# EAGLE design untitled (EAGLE 9.6.2)
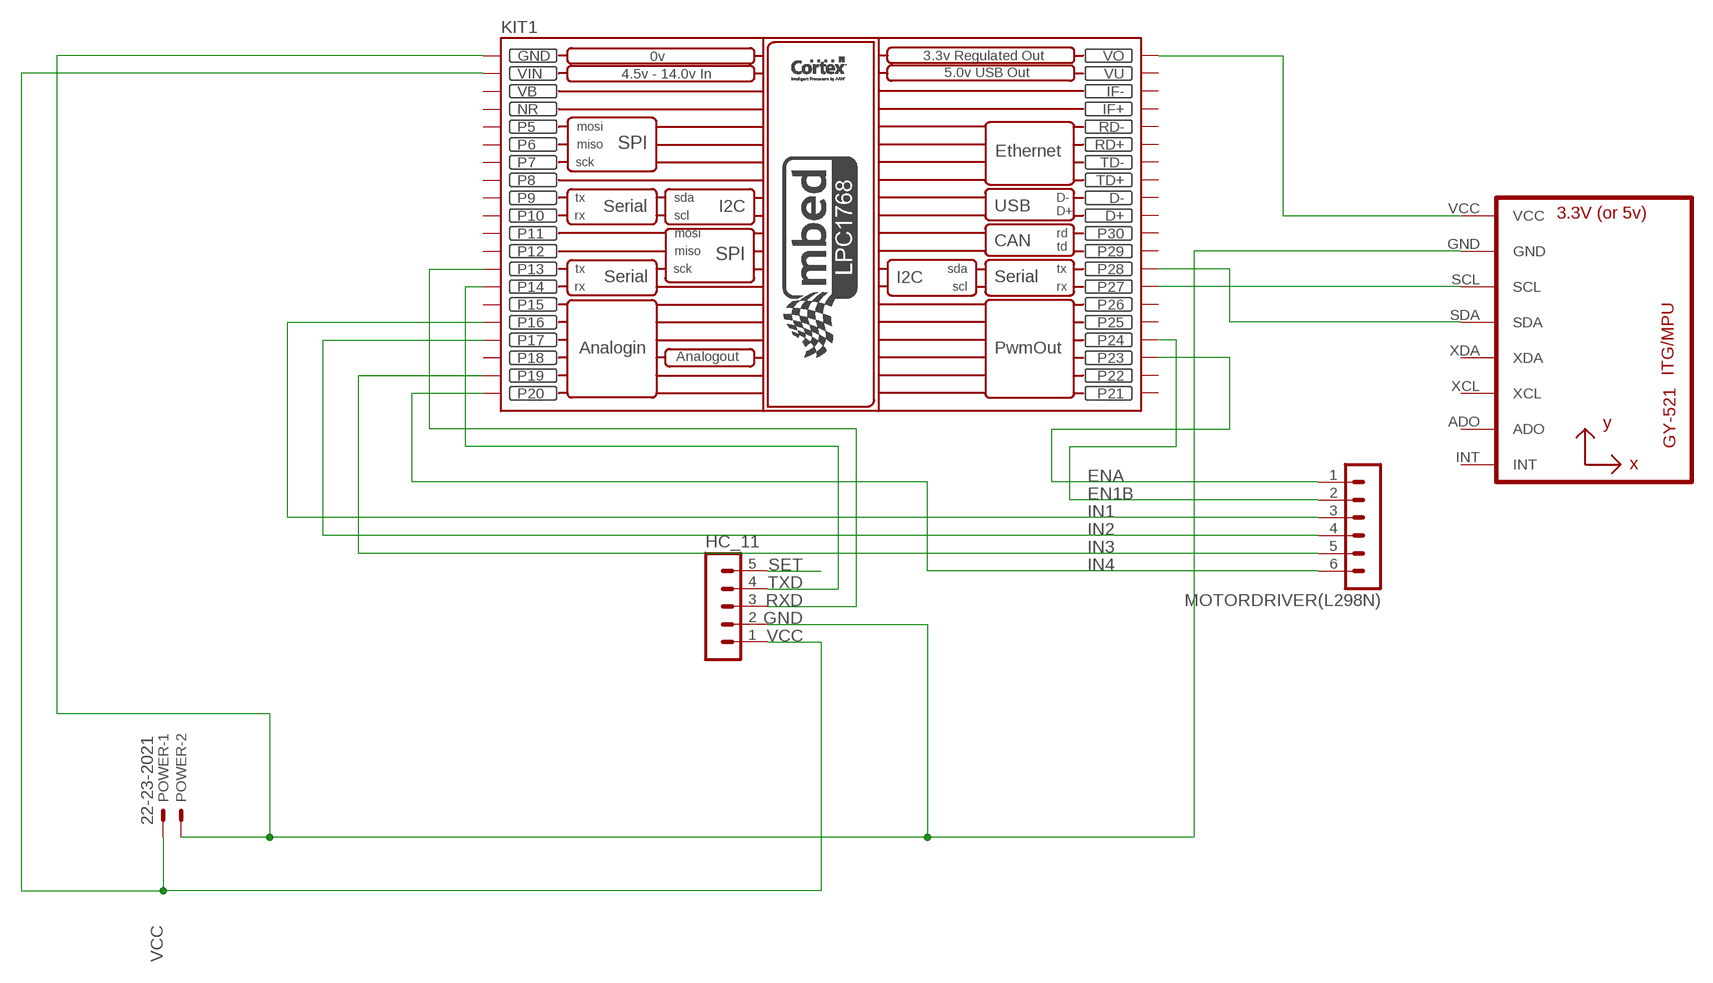
[diagram p0: schematic, sheet 1]

## Parts
HC_11  MA05-1  [MA05-1]
KIT1  MBED_NXP_LPC1768  [MBED-KIT]
MOTORDRIVER(L298N)  MA06-1  [MA06-1]
POWER  22-23-2021  [22-23-2021]
U1  GY-521MPU6050  [GY-521]

## Nets
EN1B: KIT1.P$24(P24) MOTORDRIVER(L298N).2
ENA: KIT1.P$23(P23) MOTORDRIVER(L298N).1
GND: HC_11.2 KIT1.GND POWER.2 U1.GND
IN1: KIT1.P$16(P16) MOTORDRIVER(L298N).3
IN2: KIT1.P$17(P17) MOTORDRIVER(L298N).4
IN3: KIT1.P$19(P19) MOTORDRIVER(L298N).5
IN4: KIT1.P$20(P20) MOTORDRIVER(L298N).6
N$3: KIT1.VOUT(VO) U1.VCC
RXD: HC_11.3 KIT1.P$13(P13)
SCL: KIT1.P$27(P27) U1.SCL
SDA: KIT1.P$28(P28) U1.SDA
SET: HC_11.5
TXD: HC_11.4 KIT1.P$14(P14)
VCC: HC_11.1 KIT1.VIN POWER.1
Unconnected: KIT1.D+ KIT1.D- KIT1.IF+ KIT1.IF- KIT1.P$5(P5) KIT1.P$6(P6) KIT1.P$7(P7) KIT1.P$8(P8) KIT1.P$9(P9) KIT1.P$10(P10) KIT1.P$11(P11) KIT1.P$12(P12) KIT1.P$15(P15) KIT1.P$18(P18) KIT1.P$21(P21) KIT1.P$22(P22) KIT1.P$25(P25) KIT1.P$26(P26) KIT1.P$29(P29) KIT1.P$30(P30) KIT1.RD+ KIT1.RD- KIT1.TD+ KIT1.TD- U1.ADO U1.INT U1.XCL U1.XDA

## Power pins joined to a net without a drawn wire
NR: KIT1.NR
VB: KIT1.VB
VU: KIT1.VU

## Library data of the parts
HC_11 = con-lstb:MA05-1: PIN HEADER; OC_FARNELL: unknown; OC_NEWARK: unknown
KIT1 = MBED_v2.1:MBED_NXP_LPC1768: Mbed LPC1768 - ARM CORTEX v2.1 * Schematic symbol is now placed in eagles's default raster. *The pads diameter are suitable for routing between mbed pins * mbed pads are 0.8 mm drill diameter. --------------------------------------------- Created by: Mohamed Yousry *Alexandria, Egypt *Email: mohamed.yousry@ieeegoldegypt.org
MOTORDRIVER(L298N) = con-lstb:MA06-1: PIN HEADER; OC_FARNELL: unknown; OC_NEWARK: unknown
POWER = con-molex:22-23-2021: .100" (2.54mm) Center Header - 2 Pin; MF: MOLEX; MPN: 22-23-2021; OC_FARNELL: 1462926; OC_NEWARK: 25C3832
U1 = gy-521 (1):GY-521

## Board
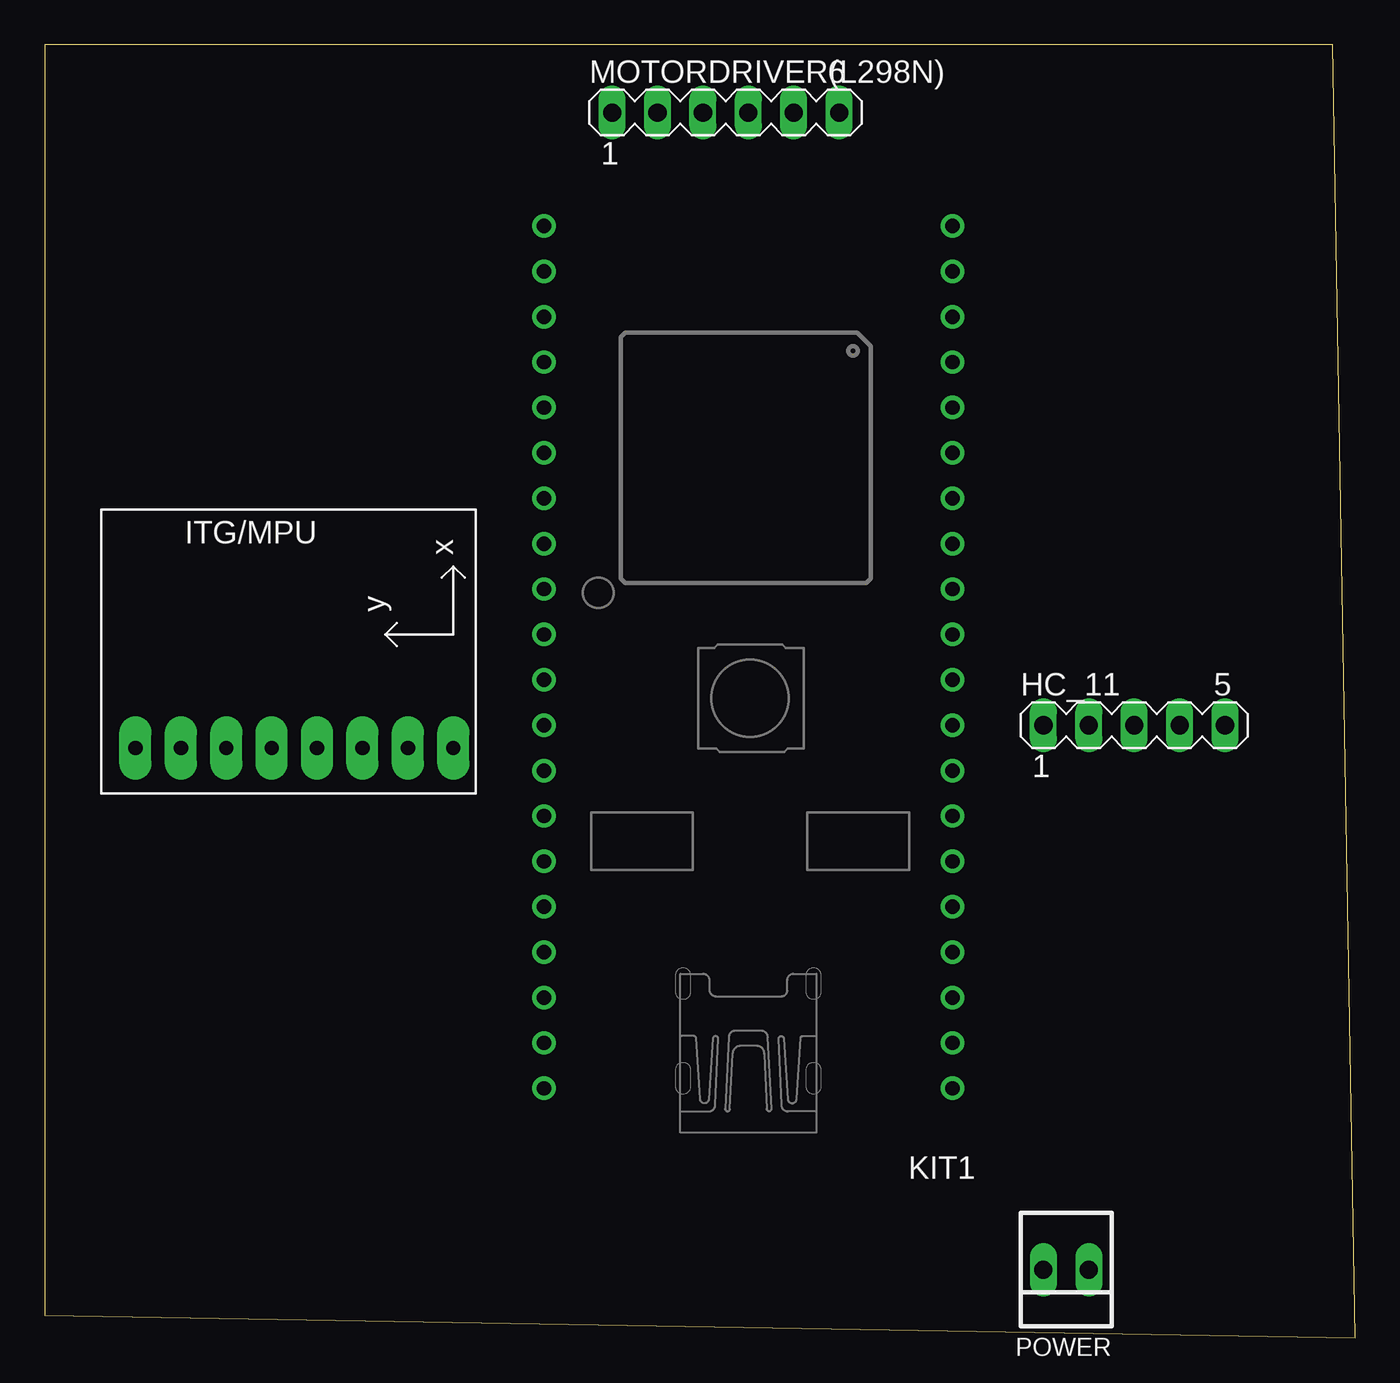
[diagram p1: board, top side]
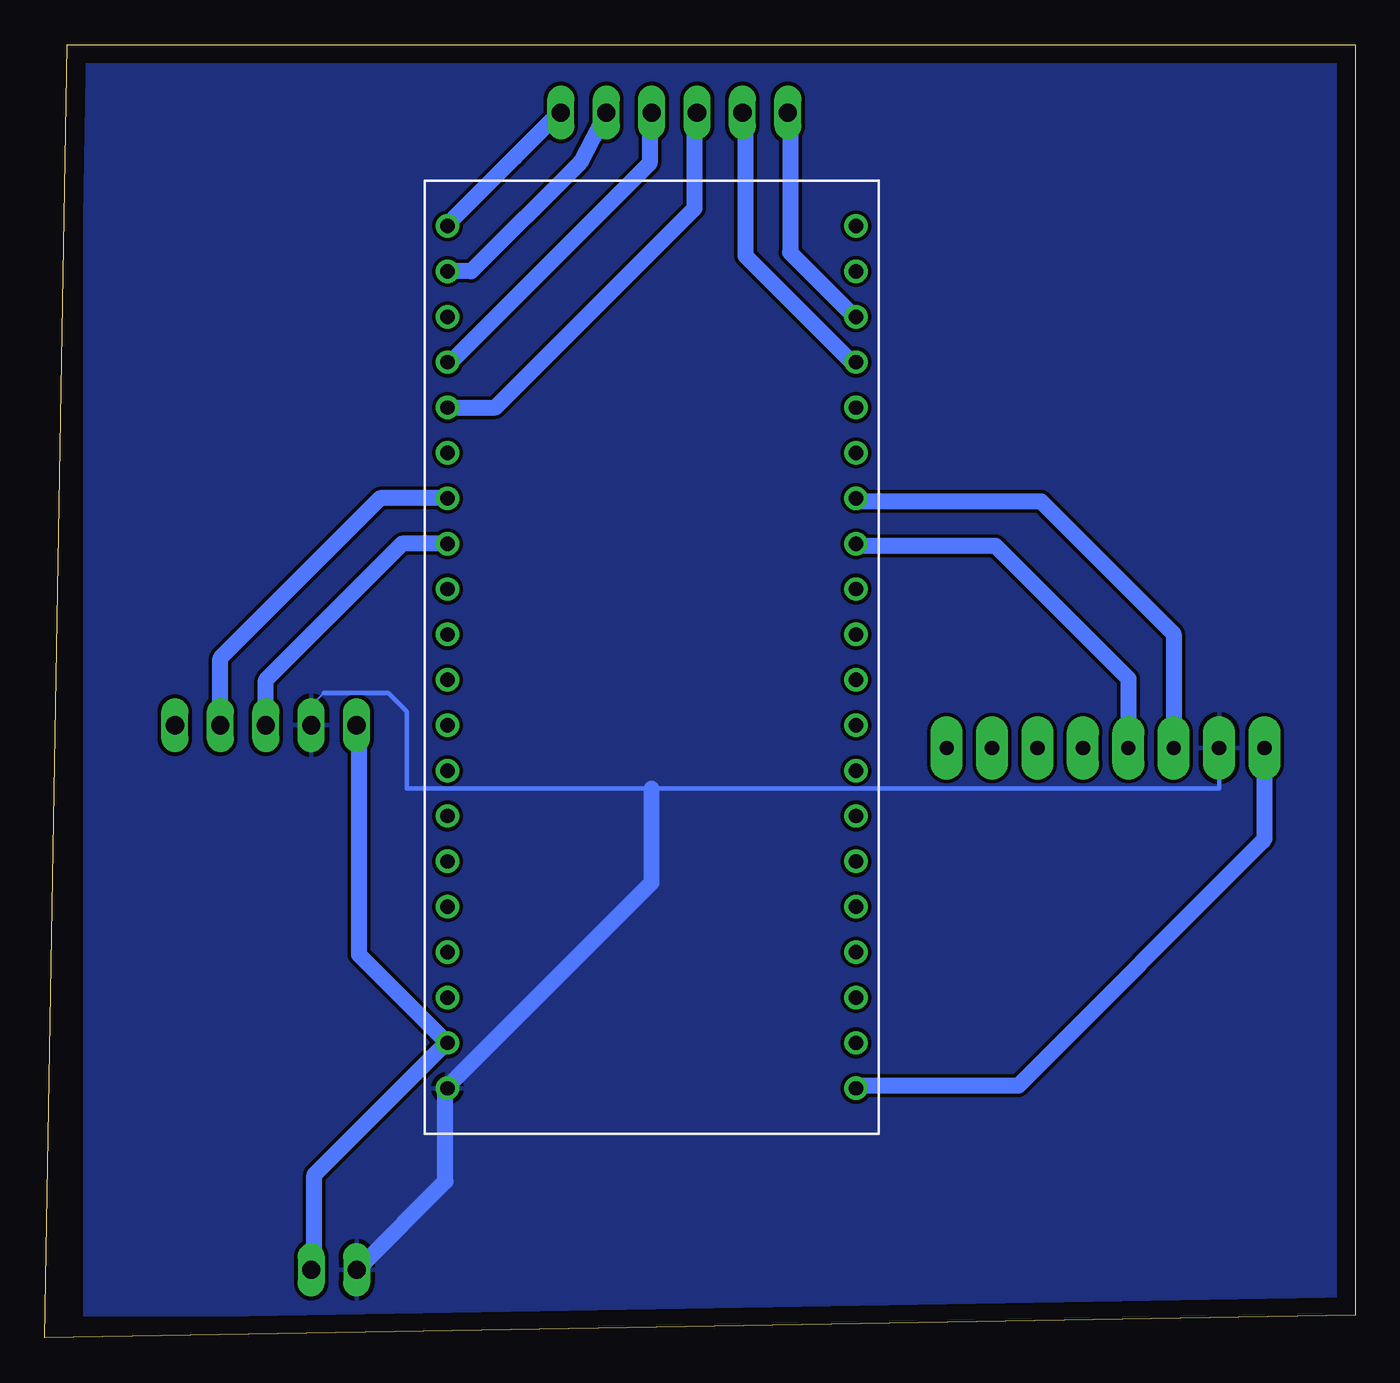
[diagram p2: board, bottom side, seen from below]

Size 73.33 x 72.38 mm. Coordinates in mm from the lower left corner, seen from the top.
Outline: 0,1.27 73.33,0 72.06,72.38 0,72.38 0,1.27
Copper layers (1*16): Top 0.035mm / dielectric 1.5mm / Bottom 0.035mm
Design rules "default": minimum track width 6mil, minimum drill 0.35mm, track to track 6mil, track to pad 6mil, pad to pad 6mil, via to via 6mil, smd to smd 6mil, copper to edge 40mil, drill to drill 6mil, minimum pad ring 10mil, minimum via ring 8mil, stop-mask expansion 4mil, vias tented up to drill 0mil, thermal gap 10mil

### Footprints (pad centres in the part's own frame; a part is rotated, then mirrored left to right if it is on the bottom)
MA05-1 = drill 1.016 long: 1 -5.08,0; 2 -2.54,0; 3 0,0; 4 2.54,0; 5 5.08,0
MBED-KIT = drill 0.8: D+ 11.43,1.27; D- 11.43,3.81; GND -11.43,24.13; IF+ 11.43,16.51; IF- 11.43,19.05; NR -11.43,16.51; P$5 -11.43,13.97; P$6 -11.43,11.43; P$7 -11.43,8.89; P$8 -11.43,6.35; P$9 -11.43,3.81; P$10 -11.43,1.27; P$11 -11.43,-1.27; P$12 -11.43,-3.81; P$13 -11.43,-6.35; P$14 -11.43,-8.89; P$15 -11.43,-11.43; P$16 -11.43,-13.97; P$17 -11.43,-16.51; P$18 -11.43,-19.05; P$19 -11.43,-21.59; P$20 -11.43,-24.13; P$21 11.43,-24.13; P$22 11.43,-21.59; P$23 11.43,-19.05; P$24 11.43,-16.51; P$25 11.43,-13.97; P$26 11.43,-11.43; P$27 11.43,-8.89; P$28 11.43,-6.35; P$29 11.43,-3.81; P$30 11.43,-1.27; RD+ 11.43,11.43; RD- 11.43,13.97; TD+ 11.43,6.35; TD- 11.43,8.89; VB -11.43,19.05; VIN -11.43,21.59; VOUT 11.43,24.13; VU 11.43,21.59
MA06-1 = drill 1.016 long: 1 -6.35,0; 2 -3.81,0; 3 -1.27,0; 4 1.27,0; 5 3.81,0; 6 6.35,0
22-23-2021 = drill 1 long: 1 -1.27,0; 2 1.27,0
GY-521 = drill 0.8 pad 1.778 long: ADO -8.89,-6.35; GND -8.89,6.35; INT -8.89,-8.89; SCL -8.89,3.81; SDA -8.89,1.27; VCC -8.89,8.89; XCL -8.89,-3.81; XDA -8.89,-1.27

### Placement (x,y rotation side)
HC_11  60.96,34.29 0 top
KIT1  39.37,38.1 180 top
MOTORDRIVER(L298N)  38.1,68.58 0 top
POWER  57.15,3.81 180 top
U1  13.97,41.91 90 top

### Tracks (layer width: path | path; a pad name or v marks a point on that pad's centre or on a via)
EN1B
  Bottom 0.152: KIT1.P$24 28.17,54.61 | 34.12,68.44 MOTORDRIVER(L298N).2
  Bottom 0.889: 28.17,54.61 34.12,60.56 34.12,68.44
ENA
  Bottom 0.152: KIT1.P$23 28.03,57.15 | 31.62,68.44 MOTORDRIVER(L298N).1
  Bottom 0.889: 28.03,57.15 31.62,60.74 31.62,68.44
GND
  Bottom 0.152: 50.92,13.94 KIT1.GND 50.74,14.12 | 55.74,3.93 POWER.2 | 58.42,35.4 57.73,36.1
  Bottom 0.254: HC_11.2 58.42,35.4 | 57.73,36.1 54.11,36.1 53.08,35.06 53.08,30.74 39.37,30.74 7.62,30.74 U1.GND
  Bottom 0.889: 50.92,13.94 50.92,8.76 55.74,3.93 | 39.37,30.74 39.37,25.49 50.74,14.12
  pour Bottom: 0,72.39 0,1.27 71.12,1.27 71.12,72.39
IN1
  Bottom 0.152: 36.98,68.44 MOTORDRIVER(L298N).3
  Bottom 0.889: KIT1.P$16 48.11,52.07 36.98,63.2 36.98,68.44
IN2
  Bottom 0.152: KIT1.P$17 50.61,54.61 | 39.48,68.44 MOTORDRIVER(L298N).4
  Bottom 0.889: 50.61,54.61 39.48,65.74 39.48,68.44
IN3
  Bottom 0.152: 50.74,59.86 KIT1.P$19
  Bottom 0.889: MOTORDRIVER(L298N).5 43.38,65.78 49.46,59.69 KIT1.P$19
IN4
  Bottom 0.152: 50.74,62.37 KIT1.P$20 | 44.48,68.62 MOTORDRIVER(L298N).6
  Bottom 0.889: 44.48,68.62 47.03,66.08 50.74,62.37
N$3
  Bottom 0.152: 27.86,14.12 KIT1.VOUT | 5.17,27.8 5.08,27.94
  Bottom 0.889: 27.86,14.12 18.85,14.12 5.17,27.8 | 5.08,27.94 U1.VCC
RXD
  Bottom 0.889: HC_11.3 60.96,36.81 53.33,44.45 KIT1.P$13
SCL
  Bottom 0.152: 27.86,46.82 KIT1.P$27
  Bottom 0.889: 27.86,46.82 17.58,46.82 10.16,39.4 U1.SCL
SDA
  Bottom 0.152: 27.86,44.32 KIT1.P$28 | 12.7,36.89
  Bottom 0.889: 27.86,44.32 20.12,44.32 12.7,36.89 U1.SDA
TXD
  Bottom 0.889: HC_11.4 63.5,38.05 54.56,46.99 KIT1.P$14
VCC
  Bottom 0.152: 50.87,16.51 KIT1.VIN 50.92,16.62 | 58.24,3.93 POWER.1 | 55.74,34.13 HC_11.1
  Bottom 0.889: 50.87,16.51 58.24,9.13 58.24,3.93 | 55.74,34.13 55.74,21.44 50.92,16.62